# Altium project Eurocard.PrjPCB
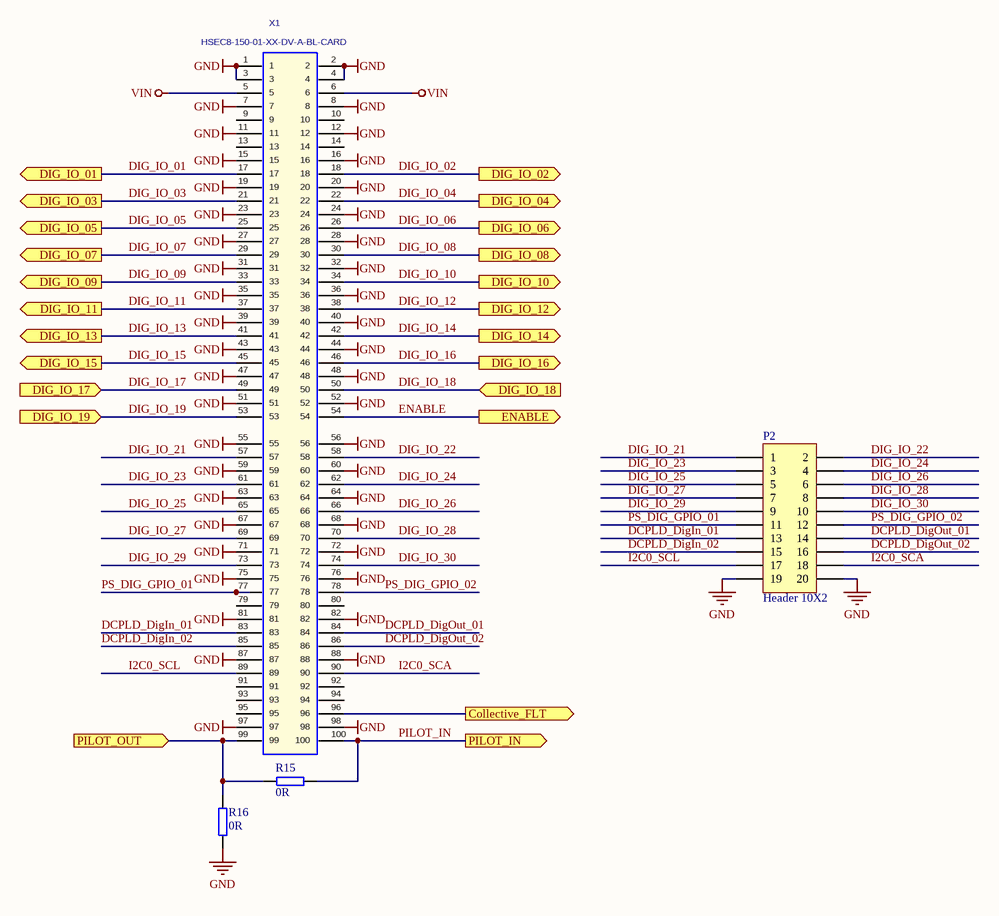
[diagram p0: CarrierConnector.SchDoc]
ProjectRevision: 2v02; ProjectName: UltraZohm_Digital_Optical_16Tx_3Rx; Date: 09/2019; Author: T. Kreppel
5 sheets, 54 parts. Net scope: hierarchical (ports join the sheet entries above them; power ports are global).
Board file: Eurocard.PcbDoc
Sheets:
  CarrierConnector.SchDoc
  TopSheet.SchDoc
  Power.SchDoc
  Optical_TX.SchDoc
  Optical_RX.SchDoc

## Sheet CarrierConnector.SchDoc
size A4; Author: T. Kreppel; CompanyName: Technische Universität München; Organization: TUM EAL; Address1: Arcisstraße 21; Address2: 80333 München; Address3: GERMANY; Revision: 2v02; SheetNumber: 2; SheetTotal: 6; CompanyName2: Lehrstuhl für Elektrische Antriebsrechnik u. Leistungselektronik

### Parts
P2  Header 10X2  [HDR2X10]
R15  0R  [R_0603_N]
R16  0R  [R_0603_N]
X1  HSEC8-150-01-XX-DV-A-BL-CARD  [HSEC8-150-01-XX-DV-A-BL-CARD]

### Ports
Collective_FLT (out), DIG_IO_01 (out), DIG_IO_02 (out), DIG_IO_03 (out), DIG_IO_04 (out), DIG_IO_05 (out), DIG_IO_06 (out), DIG_IO_07 (out), DIG_IO_08 (out), DIG_IO_09 (out), DIG_IO_10 (out), DIG_IO_11 (out), DIG_IO_12 (out), DIG_IO_13 (out), DIG_IO_14 (out), DIG_IO_15 (out), DIG_IO_16 (out), DIG_IO_17 (in), DIG_IO_18 (in), DIG_IO_19 (in), ENABLE (out), PILOT_IN (out), PILOT_OUT (in)

### Nets
GND: P2.19 P2.20 R16.1 X1.1 X1.2 X1.3 X1.4 X1.7 X1.8 X1.11 X1.12 X1.15 X1.16 X1.19 X1.20 X1.23 X1.24 X1.27 X1.28 X1.31 X1.32 X1.35 X1.36 X1.39 X1.40 X1.43 X1.44 X1.47 X1.48 X1.51 X1.52 X1.55 X1.56 X1.59 X1.60 X1.63 X1.64 X1.67 X1.68 X1.71 X1.72 X1.75 X1.76 X1.81 X1.82 X1.87 X1.88 X1.97 X1.98
VIN: X1.5 X1.6
DCPLD_DigIn_01: P2.13 X1.83
DCPLD_DigIn_02: P2.15 X1.85
DCPLD_DigOut_01: P2.14 X1.84
DCPLD_DigOut_02: P2.16 X1.86
DIG_IO_01: X1.17 ; port DIG_IO_01
DIG_IO_02: X1.18 ; port DIG_IO_02
DIG_IO_03: X1.21 ; port DIG_IO_03
DIG_IO_04: X1.22 ; port DIG_IO_04
DIG_IO_05: X1.25 ; port DIG_IO_05
DIG_IO_06: X1.26 ; port DIG_IO_06
DIG_IO_07: X1.29 ; port DIG_IO_07
DIG_IO_08: X1.30 ; port DIG_IO_08
DIG_IO_09: X1.33 ; port DIG_IO_09
DIG_IO_10: X1.34 ; port DIG_IO_10
DIG_IO_11: X1.37 ; port DIG_IO_11
DIG_IO_12: X1.38 ; port DIG_IO_12
DIG_IO_13: X1.41 ; port DIG_IO_13
DIG_IO_14: X1.42 ; port DIG_IO_14
DIG_IO_15: X1.45 ; port DIG_IO_15
DIG_IO_16: X1.46 ; port DIG_IO_16
DIG_IO_17: X1.49 ; port DIG_IO_17
DIG_IO_18: X1.50 ; port DIG_IO_18
DIG_IO_19: X1.53 ; port DIG_IO_19
DIG_IO_21: P2.1 X1.57
DIG_IO_22: P2.2 X1.58
DIG_IO_23: P2.3 X1.61
DIG_IO_24: P2.4 X1.62
DIG_IO_25: P2.5 X1.65
DIG_IO_26: P2.6 X1.66
DIG_IO_27: P2.7 X1.69
DIG_IO_28: P2.8 X1.70
DIG_IO_29: P2.9 X1.73
DIG_IO_30: P2.10 X1.74
ENABLE: X1.54 ; port ENABLE
I2C0_SCA: P2.18 X1.90
I2C0_SCL: P2.17 X1.89
PILOT_IN: R15.2 X1.100 ; port PILOT_IN
PS_DIG_GPIO_01: P2.11 X1.77
PS_DIG_GPIO_02: P2.12 X1.78
NetR15_1: R15.1 R16.2 X1.99 ; port PILOT_OUT
NetX1_96: X1.96 ; port Collective_FLT

Not connected (* = marked no-connect by the designer): X1 9 10 13 14 79 80 91 92 93 94 95

### Notes on the sheet
- Title
- Size:
- Date:
- A4
- Revision:
- Time:
- Sheet
- of
- Author:
- Project:

### Library data of the parts
P2 = Header 10X2: Header, 10-Pin, Dual row; LatestRevisionDate: 17-Jul-2002; LatestRevisionNote: Re-released for DXP Platform.; Publisher: Altium Limited
R15 R16 = R_0603: SMD Resistor 0603; MPN: CRCW06030000Z0EBC; Tolerance: 1%; Voltage: 75V; Power: 100 mW; MF: Vishay; Package: 0603; Value: 0R; Created: 2018_09_06_AGeiger; Supplier 1: Mouser; Supplier Part Number 1: 71-CRCW06030000Z0EBC
X1 = HSEC8-150-01-XX-DV-A-BL-CARD: Mating Card Layout for HSEC8-150-01-XX-DV-A-BL; Manufacturer: SAMTEC; Created: 2018_04_23_AGeiger; Value: HSEC8-150-01-XX-DV-A-BL-CARD

## Sheet TopSheet.SchDoc
size A4; CompanyName: Technische Hochschule Nürnberg Georg Simon Ohm; Address1: Fürther Straße 250; Address2: 90429 Nürnberg; Address3: GERMANY; DocumentNumber: 1; SheetNumber: 1; SheetTotal: 16; CompanyName2: Institut ELSYS
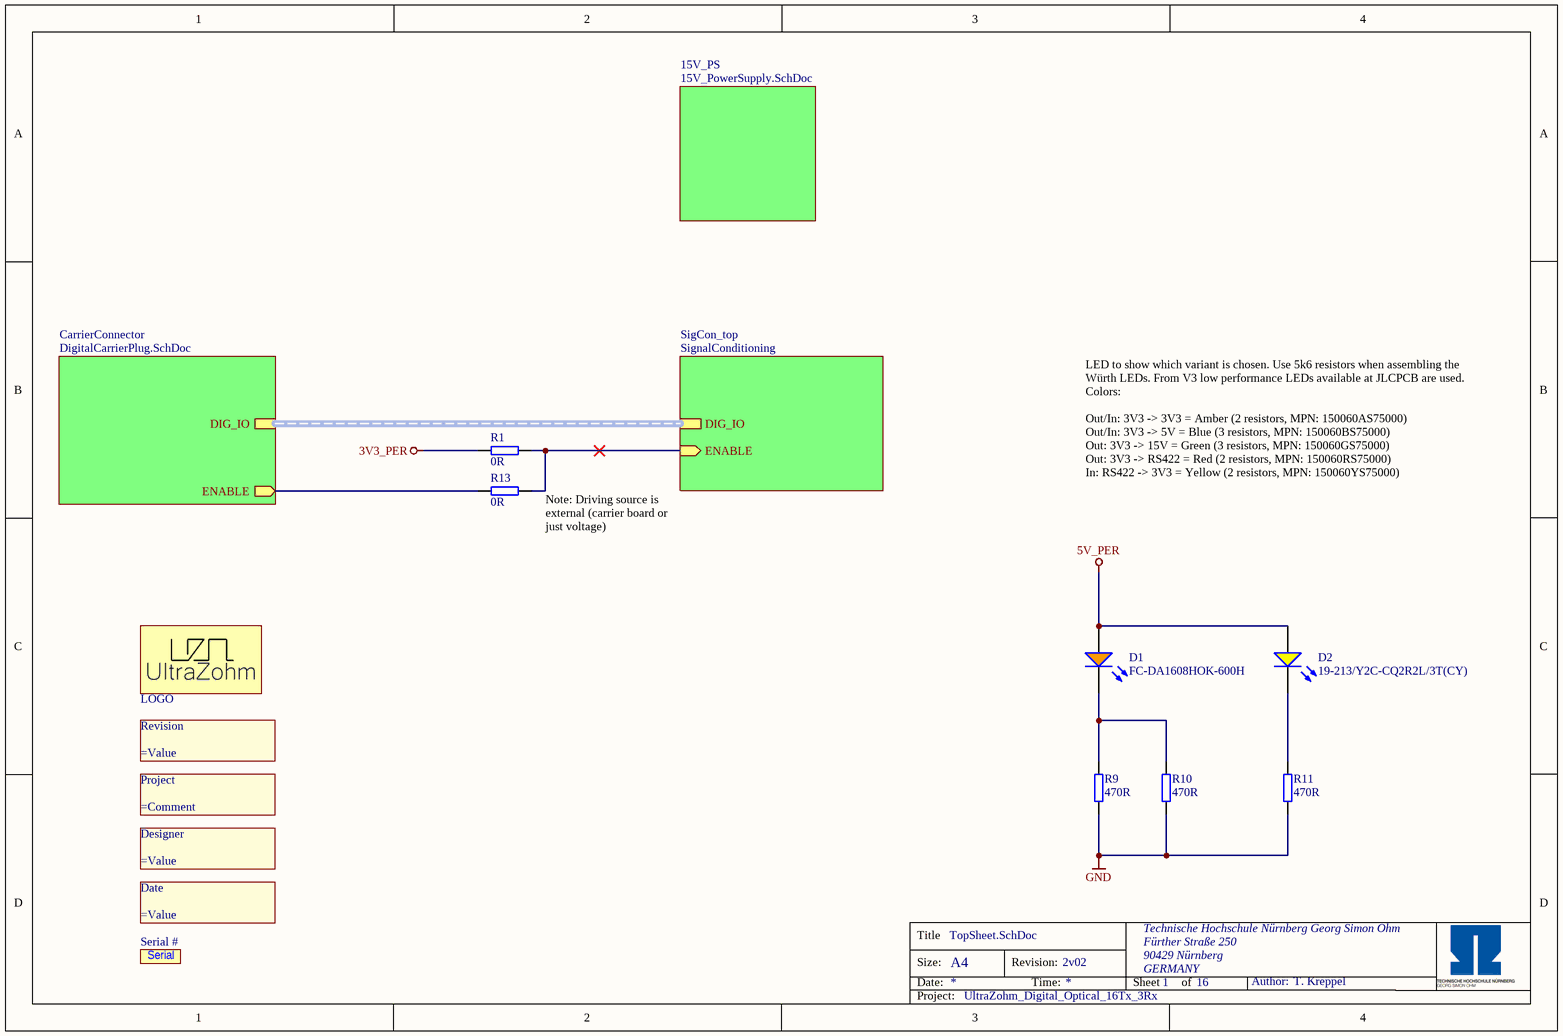
[diagram p1: TopSheet.SchDoc]

### Parts
(Parts that share a designator on the sheet are numbered #1, #2 ... from top to bottom, then left to right.)
D1#1  FC-DA1608HOK-600H  [WL-SMCW_0603]
D2#1  19-213/Y2C-CQ2R2L/3T(CY)  [WL-SMCW_0603]
Date  (no value)  [COMMENT]  (no BOM)
Designer  (no value)  [Designator:comment]  (no BOM)
LOGO  UZ Logo  [UZ_Logo_small]  (value not drawn)  (no BOM)
Project  (no value)  [COMMENT]  (no BOM)
R1#1  0R  [RES 0603_1608]
R9  470R  [RES 0603_1608]
R10  470R  [RES 0603_1608]
R11#1  470R  [RES 0603_1608]
R13  0R  [RES 0603_1608]
Revision  (no value)  [Designator:comment]  (no BOM)
Serial  Serial #  [SERIAL]  (no BOM)

### Sub-sheets
15V_PS = 15V_PowerSupply.SchDoc (file not in this document): no entries
CarrierConnector = DigitalCarrierPlug.SchDoc (file not in this document): ENABLE (out), DIG_IO (harness DigCon_DIG_IO)
SigCon_top = SignalConditioning (file not in this document): DIG_IO (harness DigCon_DIG_IO), ENABLE (in)

### Nets
3V3_PER: R1#1.1
5V_PER: D1#1.2(A) D2#1.2(A)
GND: R9.1 R10.1 R11#1.1
NetD1#1_1: D1#1.1(K) R9.2 R10.2
NetD2#1_1: D2#1.1(K) R11#1.2
NetR1#1_2: R1#1.2 R13.2 ; sheet SigCon_top/ENABLE
NetR13_1: R13.1 ; sheet CarrierConnector/ENABLE

### Buses and harness runs
harness sheet CarrierConnector/DIG_IO = sheet SigCon_top/DIG_IO

### Notes on the sheet
- LED to show which variant is chosen. Use 5k6 resistors when assembling the Würth LEDs. From V3 low performance LEDs available at JLCPCB are used.
  Colors:
  Out/In: 3V3 -> 3V3 = Amber (2 resistors, MPN: 150060AS75000)
  Out/In: 3V3 -> 5V = Blue (3 resistors, MPN: 150060BS75000)
  Out: 3V3 -> 15V = Green (3 resistors, MPN: 150060GS75000)
  Out: 3V3 -> RS422 = Red (2 resistors, MPN: 150060RS75000)
  In: RS422 -> 3V3 = Yellow (2 resistors, MPN: 150060YS75000)
- (near R13) Note: Driving source is external (carrier board or just voltage)
- Title
- Size:
- Date:
- A4
- Revision:
- Time:
- Sheet
- of
- Author:
- Project:

### Library data of the parts
D1#1 = FC-DA1608HOK-600H: LED ORANGE 600~610NM 80~220MCD@20MA TOP VIEW 0603 ROHS; Manufacturer: Foshan NationStar Optoelectronics; Type: Standard; Created from: T. Wendt; Color: amber; Forward Current I_f: 20 mA; Forward Voltage U_f: 2 V; Wavelength: 604 nm; Light Intensity: 150 mcd; Nominal Power: 40 mW; Manufacturer Part Number: FC-DA1608HOK-600H; PartID: 10; Created On: 03.03.2021 09:59:51; ComponentLink1Description: Datasheet; ComponentLink1URL: https://datasheet.lcsc.com/szlcsc/Foshan-NationStar-Optoelectronics-FC-DA1608HOK-600H_C84269.pdf; Component Type: LED Diode; Device Package: 0603; Last Updated: 04.03.2021 09:02:50; Mounting Type: SMD; Operating Temperature: -40 - 85 °C; Supplier 1: LCSC; Supplier Part Number 1: C84269; Live Cycle Status: 1; Stock number: not stored; LCSC Part Number: C84269
D2#1 = 19-213/Y2C-CQ2R2L/3T(CY): LED YELLOW 585.5~591.5NM 90~180MCD@20MA TOP VIEW 0603 ROHS; Manufacturer: Everlight Elec; Type: Standard; Created from: T. Wendt; Forward Current I_f: 20 mA; Forward Voltage U_f: 2 V; Wavelength: 590 nm; Light Intensity: 180 mcd; Nominal Power: 40 mW; Manufacturer Part Number: 19-213/Y2C-CQ2R2L/3T(CY); PartID: 9; Created On: 03.03.2021 10:06:23; ComponentLink1Description: Datasheet; ComponentLink1URL: https://datasheet.lcsc.com/szlcsc/Everlight-Elec-19-213-Y2C-CQ2R2L-3T-CY_C72038.pdf; Component Type: LED Diode; Device Package: 0603; Last Updated: 04.03.2021 09:02:49; Mounting Type: SMD; Operating Temperature: -40 - 85 °C; Supplier 1: LCSC; Supplier Part Number 1: C72038; Live Cycle Status: 1; Stock number: not stored; Color: yellow; LCSC Part Number: C72038
Date = 5: Create a project parameter named "FinDate" this is the value of this component. It is printed on the PCB. Once the parameter is updated (e.g. new revision) it gets updated on the PCB as well; Manufacturer: PCB Manufacturer; Manufacturer Part Number: Project End Date; Created from: T. Wendt; PartID: 5; Created On: 01.03.2021 09:01:41; Component Type: Date of Project Finalization; Last Updated: 01.03.2021 09:01:41; Type: Standard (No BOM); Value: =FinDate; Live Cycle Status: 1
Designer = 4: Create a project parameter named "Author" this is the value of this component. It is printed on the PCB. Once the parameter is updated (e.g. new revision) it gets updated on the PCB as well; Manufacturer: PCB Manufacturer; Manufacturer Part Number: Project Author; Value: T. Kreppel; Created from: T. Wendt; PartID: 4; Created On: 01.03.2021 08:53:41; Component Type: Project Author; Last Updated: 01.03.2021 09:20:27; Type: Standard (No BOM); Live Cycle Status: 1
LOGO = UZ Logo: Official Project Logo of the UltraZohm; Created from: T. Wendt; PartID: 1; Created On: 19.02.2021 16:55:56; ComponentLink1Description: Homepage; ComponentLink1URL: https://ultrazohm.com; Component Type: Logo; Last Updated: 19.02.2021 17:22:43; Type: Graphical; Live Cycle Status: 1
Project = 2: Create a project parameter named "ProjectNameCustom" this is the value of this component and it is printed on the PCB.; Manufacturer: PCB Manufacturer; Created from: T. Wendt; PartID: 2; Created On: 01.03.2021 08:43:57; Component Type: Project Name; Last Updated: 01.03.2021 09:07:27; Manufacturer Part Number: Project Name; Type: Standard (No BOM); Value: =ProjectNameCustom; Live Cycle Status: 1
R1#1 R13 = RC0603JR-070RL: SMD resistor E24 series; Manufacturer: YAGEO; Tolerance: 5%; Created from: MGremer; Manufacturer Part Number: RC0603JR-070RL; PartID: 1; Created On: 14.12.2020 16:17:14; ComponentLink1Description: Datasheet; ComponentLink1URL: https://www.mouser.de/datasheet/2/447/PYu-RC_Group_51_RoHS_L_10-1664068.pdf; Component Type: SMD resistor; Device Package: 0603; Last Updated: 04.03.2021 09:09:42; Mounting Type: SMD; Supplier 1: Mouser; Supplier Part Number 1: 603-RC0603JR-070RL; Type: Resistor; Value: 0R; Live Cycle Status: 1; Stock number: Labor SMD Container; LCSC Part Number: C21189; Supplier 2: LCSC; Supplier Part Number 2: C21189
R9 R10 R11#1 = RK73B1JTTD471J: SMD resistor E24 series; Manufacturer: KOA Speer; Tolerance: 5%; Created from: MGremer; Manufacturer Part Number: RK73B1JTTD471J; PartID: 66; Created On: 14.12.2020 16:17:14; ComponentLink1Description: Datasheet; ComponentLink1URL: https://www.mouser.de/datasheet/2/219/RK73B-1825463.pdf; Component Type: SMD resistor; Device Package: 0603; Last Updated: 04.03.2021 10:03:02; Mounting Type: SMD; Supplier 1: Mouser; Supplier Part Number 1: 660-RK73B1JTTD471J; Supplier 2: LCSC; Supplier Part Number 2: C23179; Type: Resistor; Value: 470R; Live Cycle Status: 1; Stock number: Labor SMD Container; LCSC Part Number: C23179
Revision = 3: Create a project parameter named "ProjectRevision" this is the value of this component. It is printed on the PCB. Once the parameter is updated (e.g. new revision) it gets updated on the PCB as well; Manufacturer: PCB Manufacturer; Value: 2v02; Created from: T. Wendt; PartID: 3; Created On: 01.03.2021 08:50:34; Component Type: Project Revision; Last Updated: 01.03.2021 09:28:36; Manufacturer Part Number: Project Revision; Type: Standard (No BOM); Live Cycle Status: 1
Serial = 6: Field to put in a serial number; Manufacturer: PCB Manufacturer; Created from: T. Wendt; PartID: 6; Created On: 02.03.2021 14:31:24; Component Type: Serial Number; Last Updated: 02.03.2021 14:31:24; Manufacturer Part Number: Serial Number; Type: Standard (No BOM); Live Cycle Status: 1

## Sheet Power.SchDoc
size A4; Author: T. Kreppel; CompanyName: Technische Universität München; Organization: TUM EAL; Address1: Arcisstraße 21; Address2: 80333 München; Address3: GERMANY; Revision: 2v02; SheetNumber: 6; SheetTotal: 6; CompanyName2: Lehrstuhl für Elektrische Antriebsrechnik u. Leistungselektronik
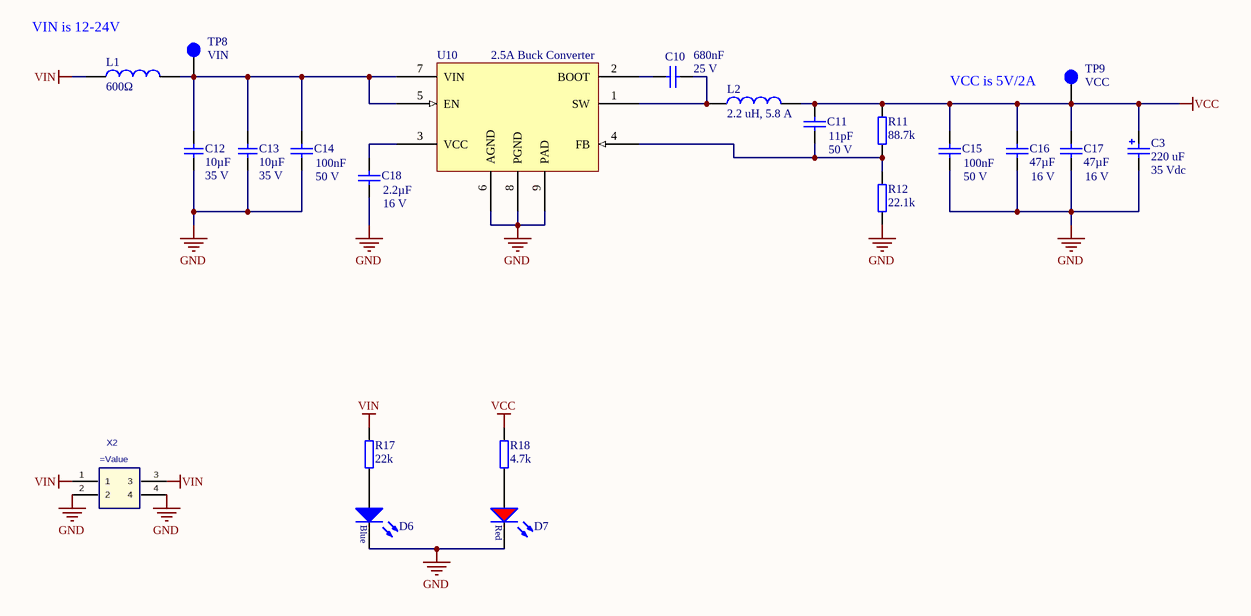
[diagram p2: Power.SchDoc]

### Parts
(Parts that share a designator on the sheet are numbered #1, #2 ... from top to bottom, then left to right.)
C3  220 uF  Voltage: 35 Vdc  [WCAP-ATG5_8x11.5x3.5]
C10  Voltage: 25 V  [C_0603(1608)100_L]  (hidden comment: 680nF)
C11  Voltage: 50 V  [C_0603(1608)100_L]  (hidden comment: 11pF)
C12  10µF  Voltage: 35 V  [C_1206]
C13  10µF  Voltage: 35 V  [C_1206]
C14  Voltage: 50 V  [C_0603(1608)100_L]  (hidden comment: 100nF)
C15  Voltage: 50 V  [C_0603(1608)100_L]  (hidden comment: 100nF)
C16  47µF  Voltage: 16 V  [C_1210_N]
C17  47µF  Voltage: 16 V  [C_1210_N]
C18  Voltage: 16 V  [C_0603(1608)100_L]  (hidden comment: 2.2µF)
D6  150060BS75000  [WL-SMCW_0603]  (value not drawn)
D7  150060RS75000  [WL-SMCW_0603]  (value not drawn)
L1  600Ω  [WE-CBF_0805_High Current]
L2  2.2 uH, 5.8 A  [SDC Inductor 4x4x2]
R11#2  88.7k  [R_0603_N]
R12  22.1k  [R_0603_N]
R17  22k  [R_0603_N]
R18  4.7k  [R_0603_N]
TP8  VIN  [TP_1mm]
TP9  VCC  [TP_1mm]
U10  2.5A Buck Converter  [SOP127P600X170_HS-9N]
X2  (no value)  [IPL1-102-01-L-D-K]

### Nets
GND: C3.2(N) C12.1 C13.1 C14.2 C15.1 C16.1 C17.1 C18.2 D6.1(K) D7.1(K) R12.1 U10.6(AGND) U10.8(PGND) U10.9(PAD) X2.2 X2.4
VCC: C3.1(P) C11.2 C15.2 C16.2 C17.2 L2.2 R11#2.2 R18.2 TP9.1
VIN: L1.1 R17.2 X2.1 X2.3
NetC10_1: C10.1 U10.2(BOOT)
NetC10_2: C10.2 L2.1 U10.1(SW)
NetC11_1: C11.1 R11#2.1 R12.2 U10.4(FB)
NetC12_2: C12.2 C13.2 C14.1 L1.2 TP8.1 U10.5(EN) U10.7(VIN)
NetC18_1: C18.1 U10.3(VCC)
NetD6_2: D6.2(A) R17.1
NetD7_2: D7.2(A) R18.1

### Notes on the sheet
- (near L1) VIN is 12-24V
- VCC is 5V/2A
- Title
- Size:
- Date:
- A4
- Revision:
- Time:
- Sheet
- of
- Author:
- Project:

### Library data of the parts
C3 = 860020574012: WCAP-ATG5 Aluminum Electrolytic Capacitors, 8x11.5mm, 35 Vdc, 220 uF; MF: Wurth Elektronik; ComponentLink1Description: Manufacturer; ComponentLink1URL: http://www.we-online.de; ComponentLink2Description: Datasheet; ComponentLink2URL: http://katalog.we-online.com/pbs/datasheet/860020574012.pdf; Part Number: 860020574012; Published Date: Sep. 2017; Size: 8x11.5mm; Life Cycle: 2000h; Operating Temperature: -40 °C up to +105 °C; Value: 220 uF; MPN: 860020574012; Supplier 1: Mouser; Supplier Part Number 1: 710-860020574012
C10 = C_0603: CAP 0603 (1608 Metric) SMD; MPN: 0603X684K250CT; Tolerance: ±10%; Case-Metric: 1608; Dielectric: X5R; Case-EIA: 0603; MF: Walsin; Max Thickness: 1 mm; Technology: SMT; Value: 680nF; Created: 2018_09_06_AGeiger; Supplier 1: Mouser; Supplier Part Number 1: 791-0603X684K250CT; Package: 0603
C11 = C_0603: CAP 0603 (1608 Metric) SMD; MPN: CC0603JRNPO9BN110; Tolerance: ±5%; Case-Metric: 1608; Dielectric: C0G; Case-EIA: 0603; MF: Yageo; Max Thickness: 1 mm; Technology: SMT; Value: 11pF; Created: 2018_09_06_AGeiger; Supplier 1: Mouser; Supplier Part Number 1: 603-CC603JRNPO9BN110; Package: 0603
C12 C13 = C_1206: Capacitor 1206; MPN: GMK316BJ106KL-T; Tolerance: 10%; MF: Taiyo Yuden; Dielectric: X5R; Package: 1206; Value: 10µF; Created: 2018_06_25_AGeiger; Supplier 1: Mouser; Supplier Part Number 1: 963-GMK316BJ106KL-T
C14 C15 = C_0603: CAP 0603 (1608 Metric) SMD; MPN: CC0603MRY5V9BB104; Tolerance: ±20%; Case-Metric: 1608; Dielectric: X5V; Case-EIA: 0603; MF: Yageo; Max Thickness: 0.8 mm; Technology: SMT; Value: 100nF; Created: 2018_09_06_AGeiger; Supplier 1: Mouser; Supplier Part Number 1: 603-C0603MRY5V9BB104; Package: 0603
C16 C17 = C_1210: Capacitor 1210; MPN: GRM32EC81C476ME15L; Dielectric: X6S; MF: Murata; Tolerance: 20%; Created: 2018_11_12_AGeiger; Package: 1210; Supplier 1: Mouser; Supplier Part Number 1: 81-GRM32EC81C476ME5L; Value: 47µF
C18 = C_0603: CAP 0603 (1608 Metric) SMD; MPN: EMK107BJ225KA-T; Tolerance: ±10%; Case-Metric: 1608; Dielectric: X5R; Case-EIA: 0603; MF: Taiyo Yuden; Max Thickness: 1 mm; Technology: SMT; Value: 2.2µF; Created: 2018_09_06_AGeiger; Supplier 1: Mouser; Supplier Part Number 1: 963-EMK107BJ225KA-T; Package: 0603
D6 = LED_Blue_0603: WL-SMCW SMD Mono-color Chip LED Waterclear, size 0603, Blue, 3.2 V, 140°; Forward Voltage: 3.2 V; Luminous Intensity: 145 mcd; Peak Wavelength: 465 nm; Dominant Wavelength: 470 nm; MF: Wuerth Elektronik; Published Date: Sep. 2017; ComponentLink1Description: Manufacturer; ComponentLink1URL: http://www.we-online.de; ComponentLink2Description: Datasheet; ComponentLink2URL: http://katalog.we-online.com/led/datasheet/150060BS75000.pdf; MPN: 150060BS75000; Size: 0603; Viewing Angle: 140°; Emitting Color: Blue; Value: 150060BS75000; Package: 0603; Created: 2018_09_06_AGeiger; Supplier 1: Farnell; Supplier Part Number 1: 2322069; Supplier 2: Mouser; Supplier Part Number 2: 710-150060BS75000; Supplier 3: Digi-Key; Supplier Part Number 3: 732-4966-1-ND
D7 = LED_Red_0603: WL-SMCW SMD Mono-color Chip LED Waterclear, size 0603, Red, 2 V, 140°; Forward Voltage: 2 V; Luminous Intensity: 250 mcd; Peak Wavelength: 630 nm; Dominant Wavelength: 625 nm; MF: Wuerth Elektronik; Published Date: Sep. 2017; ComponentLink1Description: Manufacturer; ComponentLink1URL: http://www.we-online.de; ComponentLink2Description: Datasheet; ComponentLink2URL: http://katalog.we-online.com/led/datasheet/150060RS75000.pdf; MPN: 150060RS75000; Size: 0603; Viewing Angle: 140°; Emitting Color: Red; Value: 150060RS75000; Package: 0603; Created: 2018_09_06_AGeiger; Supplier 1: Farnell; Supplier Part Number 1: 2322071; Supplier 2: Mouser; Supplier Part Number 2: 710-150060RS75000; Supplier 3: Digi-Key; Supplier Part Number 3: 732-4978-1-ND
L1 = WE-CBF, 742792040: WE-CBF SMD EMI Suppression Ferrite Bead, 0805, 600Ω; MF: Wurth Elektronik; Type: High Current; PublishedDate: Aug 2016; ComponentLink1Description: Manufacturer; ComponentLink1URL: http://www.we-online.de; ComponentLink2Description: Datasheet; ComponentLink2URL: http://katalog.we-online.de/pbs/datasheet/742792040.pdf; MPN: 742792040; Value: 600Ω; Size: 0805; Supplier 1: Farnell; Supplier 2: Mouser; Supplier 3: Digi-Key; Supplier Part Number 1: 2761567; Supplier Part Number 2: 710-742792040; Supplier Part Number 3: 732-1620-1-ND
L2 = PA4332.222NLT: SMT Shielded Tiny Power Inductor, size 4x4x2, 2.2 uH, 5.8 A; Rated Current: 5.8A; DC Resistance max.: 48 mOhm; Self Resonant Frequency: 25 MHz; Saturation Current: 6.1 A; Inductance: 2.2 uH; ComponentLink1Description: Manufacturer; ComponentLink1URL: http://www.we-online.de; ComponentLink2Description: Datasheet; ComponentLink2URL: https://katalog.we-online.com/pbs/datasheet/744031002.pdf; Part Number: PA4332.222NLT; Created: 2019_04_09_Kreppel; Publisher: Pulse Electronics; Size: 4x4x2; Operating Temperature: -40 to +125 degC; Mounting Technology: SMT; Packaging: Tape and Reel; Supplier 1: Mouser; Supplier 2: Digi-Key; Supplier Part Number 1: 673-PA4332222NLT; Supplier Part Number 2: 553-3290-1-ND
R11#2 = R_0603: SMD Resistor 0603; MPN: CRCW060388K7FKEB; Tolerance: 1%; Voltage: 75 V; Power: 100 mW; MF: Vishay; Package: 0603; Value: 88.7k; Created: 2018_09_06_AGeiger; Supplier 1: Mouser; Supplier Part Number 1: 71-CRCW060388K7FKEB
R12 = R_0603: SMD Resistor 0603; MPN: CRCW060322K1FKEA; Tolerance: 1%; Voltage: 75 V; Power: 100 mW; MF: Vishay; Package: 0603; Value: 22.1k; Created: 2018_09_06_AGeiger; Supplier 1: Mouser; Supplier Part Number 1: 71-CRCW0603-22.1K-E3
R17 = R_0603: SMD Resistor 0603; MPN: CRCW060322K0FKEAC; Tolerance: 1%; Voltage: 75V; Power: 100 mW; MF: Vishay; Package: 0603; Value: 22k; Created: 2018_09_06_AGeiger; Supplier 1: Mouser; Supplier Part Number 1: 71-CRCW060322K0FKEAC
R18 = R_0603: SMD Resistor 0603; MPN: CRCW06034K70JNEAC; Tolerance: 5%; Voltage: 75V; Power: 100 mW; MF: Vishay; Package: 0603; Value: 4.7k; Created: 2018_09_06_AGeiger; Supplier 1: Mouser; Supplier Part Number 1: 71-CRCW06034K70JNEAC
TP8 TP9 = TP_1mm: Testpoint 1mm; Created: 2018_06_25_AGeiger; Value: Testpoint 1mm
U10 = LMR23625: LMR23625 SIMPLE SWITCHER 4-36Vin, 2.5V synchronous step-down regulator; MPN: LMR23625CFDDAR; MF: Texas Instruments; Created: 2019_04_09_Kreppel; Supplier 1: Mouser; Supplier Part Number 1: 595-LMR23625CFDDAR; Value: *
X2 = IPL1-102-XX-X-D-X: 2.54mm Double Row Terminal Assembly, Right-Angled; Manufacturer: SAMTEC; Created: 2018_05_02_AGeiger; Value: =MPN; MPN: IPL1-102-01-L-D-K

## Sheet Optical_TX.SchDoc
size A4; Author: T. Kreppel; CompanyName: Technische Universität München; Organization: TUM EAL; Address1: Arcisstraße 21; Address2: 80333 München; Address3: GERMANY; Revision: 2v02; SheetNumber: 4; SheetTotal: 6; CompanyName2: Lehrstuhl für Elektrische Antriebsrechnik u. Leistungselektronik
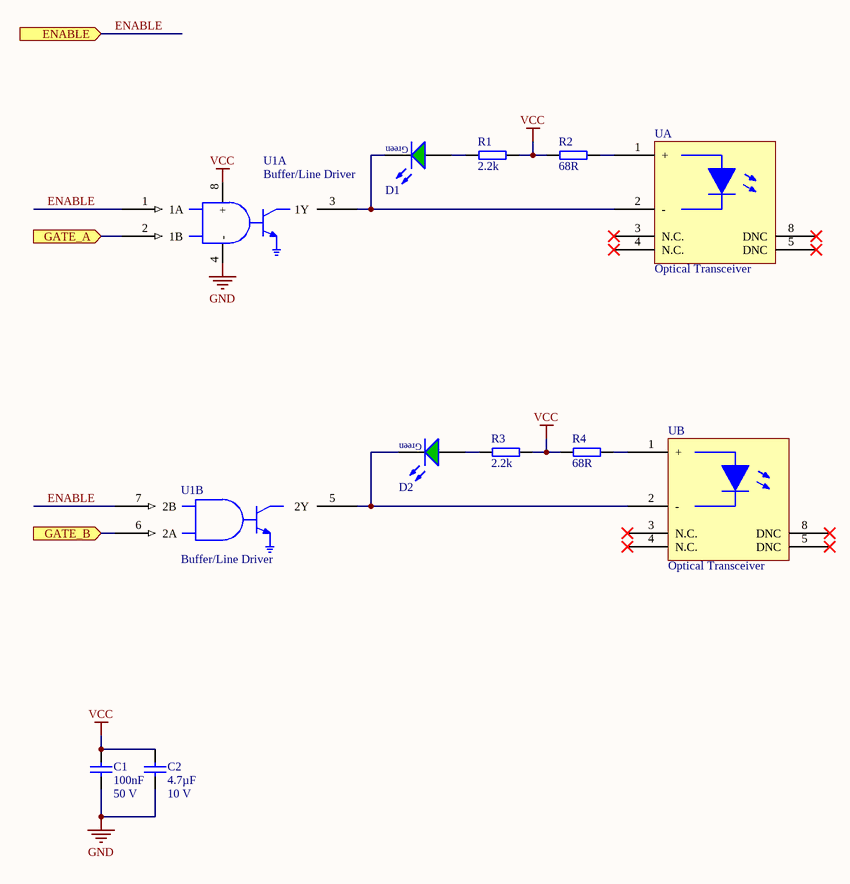
[diagram p3: Optical_TX.SchDoc]

### Parts
(Parts that share a designator on the sheet are numbered #1, #2 ... from top to bottom, then left to right.)
C1  Voltage: 50 V  [C_0603(1608)100_L]  (hidden comment: 100nF)
C2  Voltage: 10 V  [C_0603(1608)100_L]  (hidden comment: 4.7µF)
D1#2  150060GS75000  [WL-SMCW_0603]  (value not drawn)
D2#2  150060GS75000  [WL-SMCW_0603]  (value not drawn)
R1#2  2.2k  [R_0603_N]
R2  68R  [R_0603_N]
R3  2.2k  [R_0603_N]
R4  68R  [R_0603_N]
U1  Buffer/Line Driver  [SOIC127P600X175-8N]  (parts A,B of 2)
UA  Optical Transceiver  [HFBRx5XX]
UB  Optical Transceiver  [HFBRx5XX]

### Ports
ENABLE (in), GATE_A (in), GATE_B (in)

### Nets
GND: C1.2 C2.2 U1.4(-)
VCC: C1.1 C2.1 R1#2.1 R2.2 R3.1 R4.2 U1.8(+)
ENABLE: U1.1(1A) U1.7(2B) ; port ENABLE
NetD1#2_1: D1#2.1(K) U1.3(1Y) UA.2(-)
NetD1#2_2: D1#2.2(A) R1#2.2
NetD2#2_1: D2#2.1(K) U1.5(2Y) UB.2(-)
NetD2#2_2: D2#2.2(A) R3.2
NetR2_1: R2.1 UA.1(+)
NetR4_1: R4.1 UB.1(+)
NetU1_2: U1.2(1B) ; port GATE_A
NetU1_6: U1.6(2A) ; port GATE_B

Not connected (* = marked no-connect by the designer): UA 3(N.C.)* 4(N.C.)* 5(DNC)* 8(DNC)*; UB 3(N.C.)* 4(N.C.)* 5(DNC)* 8(DNC)*

### Notes on the sheet
- Title
- Size:
- Date:
- A4
- Revision:
- Time:
- Sheet
- of
- Author:
- Project:

### Library data of the parts
C1 = C_0603: CAP 0603 (1608 Metric) SMD; MPN: CC0603MRY5V9BB104; Tolerance: ±20%; Case-Metric: 1608; Dielectric: X5V; MF: Yageo; Case-EIA: 0603; Max Thickness: 1 mm; Technology: SMT; Created: 2018_09_06_AGeiger; Supplier 1: Mouser; Supplier Part Number 1: 603-C0603MRY5V9BB104; Value: 100nF; Package: 0603
C2 = C_0603: CAP 0603 (1608 Metric) SMD; MPN: LMK107BJ475KA-T; Tolerance: ±10%; Case-Metric: 1608; Dielectric: X5R; MF: Taio Yuden; Case-EIA: 0603; Max Thickness: 1 mm; Technology: SMT; Created: 2018_09_06_AGeiger; Supplier 1: Mouser; Supplier Part Number 1: 963-LMK107BJ475KA-T; Value: 4.7µF; Package: 0603
D1#2 D2#2 = LED_Green_0603: WL-SMCW SMD Mono-color Chip LED Waterclear, size 0603, Green, 3.2 V, 140°; Forward Voltage: 3.2 V; Luminous Intensity: 430 mcd; Peak Wavelength: 515 nm; Dominant Wavelength: 520 nm; MF: Wuerth Elektronik; Published Date: Sep. 2017; ComponentLink1Description: Manufacturer; ComponentLink1URL: http://www.we-online.de; ComponentLink2Description: Datasheet; ComponentLink2URL: http://katalog.we-online.com/led/datasheet/150060GS75000.pdf; MPN: 150060GS75000; Size: 0603; Viewing Angle: 140°; Emitting Color: Green; Value: 150060GS75000; Package: 0603; Created: 2018_09_06_AGeiger; Supplier 1: Farnell; Supplier Part Number 1: 2322070; Supplier 2: Mouser; Supplier Part Number 2: 710-150060GS75000; Supplier 3: Digi-Key; Supplier Part Number 3: 732-4971-1-ND
R1#2 R3 = R_0603: SMD Resistor 0603; MPN: CRCW06032K20FKEAC; Tolerance: 1%; Voltage: 75V; Power: 100 mW; MF: Vishay; Package: 0603; Value: 2.2k; Created: 2018_09_06_AGeiger; Supplier 1: Mouser; Supplier Part Number 1: 71-CRCW06032K20FKEAC
R2 R4 = R_0603: SMD Resistor 0603; MPN: RCS060368R0FKEA; Tolerance: 1%; Voltage: 75V; Power: 250 mW; MF: Vishay; Package: 0603; Value: 68R; Created: 2018_09_06_AGeiger; Supplier 1: Mouser; Supplier Part Number 1: 71-RCS060368R0FKEA
U1 = SN75452BDR: Buffers & Line Drivers Dual Very-HS HC Peripheral Drivers; MF: Texas Instruments; Supply Voltage: 4.75-5.25 V; Created: 2019_04_09_Kreppel; MPN: SN75452BDR; Package: SOIC-8; Supplier 1: Mouser; Supplier Part Number 1: 595-SN75452BDR
UA UB = HFBR-1521Z: Fibre Optic Transmitters, Receivers, Transceivers Versatile Link Horiz 5MBd Tx RoHS; MF: Broadcom/Avago; Wavelength: 660 nm; Foreward Current: 60 mA; Supply Voltage: 5V; Created: 2019_04_09_Kreppel; MPN: HFBR-1521Z; Data Rate: 5 MBd; Supplier 1: Mouser; Supplier 2: Digi-Key; Supplier Part Number 1: 630-HFBR-1521Z; Supplier Part Number 2: 516-2043-ND

## Sheet Optical_RX.SchDoc
size A4; Author: T. Kreppel; CompanyName: Technische Universität München; Organization: TUM EAL; Address1: Arcisstraße 21; Address2: 80333 München; Address3: GERMANY; Revision: 2v02; SheetNumber: 5; SheetTotal: 6; CompanyName2: Lehrstuhl für Elektrische Antriebsrechnik u. Leistungselektronik
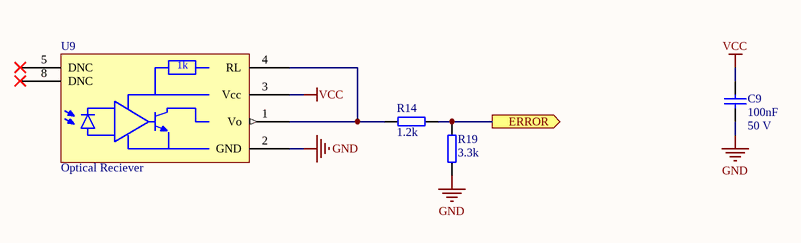
[diagram p4: Optical_RX.SchDoc]

### Parts
C9  Voltage: 50 V  [C_0603(1608)100_L]  (hidden comment: 100nF)
R14  1.2k  [R_0603_N]
R19  3.3k  [R_0603_N]
U9  Optical Reciever  [HFBRx5XX]

### Ports
ERROR (out)

### Nets
GND: C9.2 R19.1 U9.2(GND)
VCC: C9.1 U9.3(Vcc)
NetR14_1: R14.1 U9.1(Vo) U9.4(RL)
NetR14_2: R14.2 R19.2 ; port ERROR

Not connected (* = marked no-connect by the designer): U9 5(DNC)* 8(DNC)*

### Notes on the sheet
- Title
- Size:
- Date:
- A4
- Revision:
- Time:
- Sheet
- of
- Author:
- Project:
- (in symbol HFBR-2528Z) 1k

### Library data of the parts
C9 = C_0603: as C1 on sheet Optical_TX; Max Thickness: 1 mm; Technology: SMT; Created: 2018_09_06_AGeiger; Supplier 1: Mouser; Supplier Part Number 1: 603-C0603MRY5V9BB104; Value: 100nF; Package: 0603
R14 = R_0603: SMD Resistor 0603; MPN: RC0603FR-071K2L; Tolerance: 1%; Voltage: 75 V; Power: 100 mW; MF: Yageo; Package: 0603; Value: 1.2k; Created: 2018_09_06_AGeiger; Supplier 1: Mouser; Supplier Part Number 1: 603-RC0603FR-071K2L
R19 = R_0603: SMD Resistor 0603; MPN: CRCW06033K30FKEAC; Tolerance: 1%; Voltage: 75 V; Power: 100 mW; MF: Vishay; Package: 0603; Value: 3.3k; Created: 2018_09_06_AGeiger; Supplier 1: Mouser; Supplier Part Number 1: 71-CRCW06033K30FKEAC
U9 = HFBR-2528Z: Fibre Optic Transmitters, Receivers, Transceivers V-LINK HORIZ 5MBd RC VR RoHS; MPN: HFBR-2521Z; Suppier Part Number 2: 516-2062-ND; MF: Boadcom/Avago; Wavelength: 660 nm; Iout max: 25 mA; Supply Voltage: 5V; Created: 2019_04_09_Kreppel; Data Rate: 5 MBd; Supplier 1: Mouser; Supplier 2: Digi-Key; Supplier Part Number 1: 630-HFBR-2521Z

## Nets that join several sheets
GND: CarrierConnector (49 pins), TopSheet (R9.1 R10.1 R11#1.1), Power (16 pins), Optical_TX (C1.2 C2.2 U1.4), Optical_RX (C9.2 R19.1 U9.2)
VCC: Power (9 pins), Optical_TX (7 pins), Optical_RX (C9.1 U9.3)
VIN: CarrierConnector (X1.5 X1.6), Power (L1.1 R17.2 X2.1 X2.3)

## Assembly variants
Standard: not fitted P1 P2 R16 X2